# Altium schematic sheet Controles_8POV.SchDoc
size A4; SheetNumber: 22; SheetTotal: 22
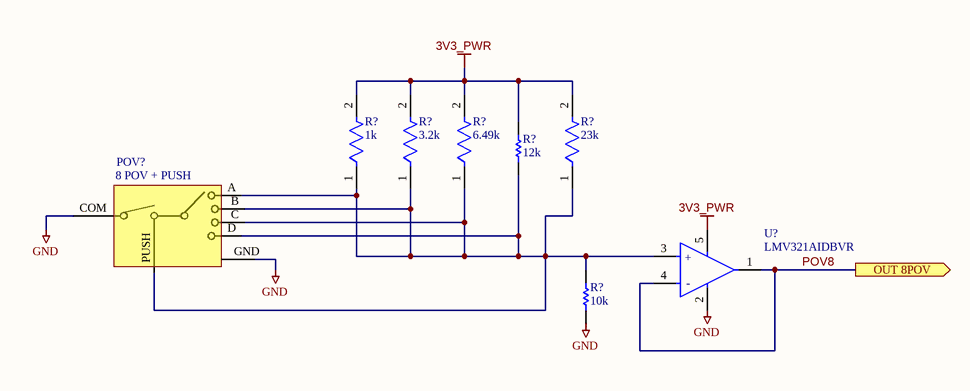
[diagram p0: Controles_8POV.SchDoc]

## Parts
(Parts that share a designator on the sheet are numbered #1, #2 ... from top to bottom, then left to right.)
POV?  8 POV + PUSH  [RKJXM1015004]
R?#1  12k  [RESC0402(1005)_M]
R?#2  1k  [FP-MCS0402-IPC_B]
R?#3  3.2k  [FP-RN73R1E-IPC_A]
R?#4  6.49k  [FP-MCS0402-IPC_A]
R?#5  23k  [FP-AC0402-MFG]
R?#6  10k  [RESC1005X40X25ML05T05]
U?  LMV321AIDBVR  [FP-DBV0005A-MFG]

## Ports
OUT 8POV (out)

## Nets
3V3_PWR: R?#1.2 R?#2.2 R?#3.2 R?#4.2 R?#5.2 U?.5(V+)
GND: POV?.COM POV?.GND R?#6.1 U?.2(V-)
POV8: U?.1(OUT) U?.4(-IN) ; port OUT 8POV
NetPOV?_A: POV?.A(DIRA) POV?.B(DIRB) POV?.C(DIRC) POV?.D(DIRD) POV?.PUSH R?#1.1 R?#2.1 R?#3.1 R?#4.1 R?#5.1 R?#6.2 U?.3(+IN)

## Notes on the sheet
- (in symbol CMP-04895-000333-1) +; -

## Library data of the parts
POV? = RKJXM1015004: 8-directional Stick Switch (with Center-push Function) RKJXM Series
R?#1 = CMP-1011-00100-1: 12K 0.063W 5% 0402 (1005 Metric)  SMD; Case-Metric: 1005; Value: 12000.00 Ohm; Case-EIA: 0402; Technology: SMT; Tolerance: 5 %; Power: 0.063 W
R?#2 = CMP-2002-02445-2: RES SMD 1.2K OHM 1% 1/10W 0402; Resistance: 1kR; Tolerance: 0.1%; Max Power Dissipation: 63mW; Temperature Coefficient: 25ppm/°C; Max Operating Temperature: 125°C; Min Operating Temperature: -55°C; Case/Package: 0402; Packaging: Tape and Reel; Width: 0.02inch; Lead Free: Lead Free; Number of Terminations: 2; Height: 0.015inch; Package Quantity: 10000; Length: 0.039inch; Composition: Thin Film; Contact Plating: Tin; Depth: 0.5mm; Military Standard: Not
R?#3 = CMP-04015-034609-1: 3.2kΩ ±0.1% 0.063W, 1/16W Chip Resistor 0402 (1005 Metric) Moisture Resistant Thin Film
R?#4 = CMP-02407-008176-1: RES SMD 1.2K OHM 1% 1/10W 0402; Temperature Coefficient: 50ppm/°C; Resistance: 6.49kR; Max Power Dissipation: 100mW; Packaging: Tape and Reel; Lead Free: Lead Free; Tolerance: 1%; Case/Package: 0402; Length: 0.039inch; Height: 0.015inch; Package Quantity: 10000; Depth: 0.5mm; Composition: Thin Film; Width: 0.02inch; Min Operating Temperature: -55°C; Number of Terminations: 2; Military Standard: Not; Max Operating Temperature: 155°C
R?#5 = CMP-03412-015848-2: RES 23.2kΩ ±1% 0.063W 0402; Resistance: 23.2kR; Max Power Dissipation: 63mW; Temperature Coefficient: 100ppm/°C; Features: Moisture Resistant; Military Standard: Not; Max Operating Temperature: 155°C; RoHS Compliant: Yes; Resistor Type: Thick Film; Min Operating Temperature: -55°C; Length: 0.039inch; Height: 0.015inch; Number of Terminations: 2; Width: 0.02inch; Series: AC; Depth: 0.5mm; Tolerance: 1%; Packaging: Tape and Reel; Case/Package: 0402
R?#6 = CMP-2002-00601-1: Manufacturer: Panasonic; Part Number: ERJ-2RHD1002X
U? = CMP-04895-000333-1: IC OPAMP GP 1 CIRCUIT SOT23-5; Input Bias Current: 10pA; Output Current per Channel: 40mA; Gain Bandwidth Product: 1MHz; Input Offset Voltage (Vos): 1mV; Number of Channels: 1; Operating Supply Current: 80uA; Slew Rate: 1.7V/µs; Mount: Surface Mount; Min Operating Temperature: -40°C; Packaging: Cut Tape; Case/Package: SOT-23-5; RoHS Compliant: Yes; Max Operating Temperature: 125°C; Number of Circuits: 1